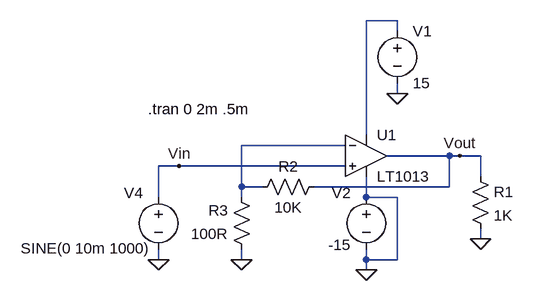
[diagram p0: schematic Opamp non-inverting.asc]
Opamp non-inverting.asc, the LTspice schematic file:
Version 4
SHEET 1 880 680
WIRE 288 -64 240 -64
WIRE 288 -48 288 -64
WIRE 288 48 288 32
WIRE 240 112 240 -64
WIRE 208 128 48 128
WIRE 368 144 272 144
WIRE 384 144 368 144
WIRE 416 144 384 144
WIRE -48 160 -80 160
WIRE 208 160 -48 160
WIRE 416 176 416 144
WIRE 48 192 48 128
WIRE 80 192 48 192
WIRE 368 192 368 144
WIRE 368 192 160 192
WIRE -80 208 -80 160
WIRE 48 208 48 192
WIRE 240 208 240 176
WIRE 288 208 240 208
WIRE 416 272 416 256
WIRE -80 304 -80 288
WIRE 48 304 48 288
WIRE 240 304 240 288
WIRE 288 304 288 208
WIRE 288 304 240 304
WIRE 240 320 240 304
FLAG 288 48 0
FLAG 240 320 0
FLAG 384 144 Vout
FLAG 416 272 0
FLAG -80 304 0
FLAG 48 304 0
FLAG -48 160 Vin
SYMBOL Opamps\\LT1013 240 80 R0
SYMATTR InstName U1
SYMBOL voltage 288 -64 R0
WINDOW 123 0 0 Left 2
WINDOW 39 0 0 Left 2
SYMATTR InstName V1
SYMATTR Value 15
SYMBOL res 400 160 R0
SYMATTR InstName R1
SYMATTR Value 1K
SYMBOL voltage -80 192 R0
WINDOW 0 -53 9 Left 2
WINDOW 3 -212 95 Left 2
WINDOW 123 0 0 Left 2
WINDOW 39 0 0 Left 2
SYMATTR InstName V4
SYMATTR Value SINE(0 10m 1000)
SYMBOL voltage 240 192 R0
WINDOW 0 -53 9 Left 2
WINDOW 3 -58 89 Left 2
WINDOW 123 0 0 Left 2
WINDOW 39 0 0 Left 2
SYMATTR InstName V2
SYMATTR Value -15
SYMBOL res 176 176 R90
WINDOW 0 0 56 VBottom 2
WINDOW 3 32 56 VTop 2
SYMATTR InstName R2
SYMATTR Value 10K
SYMBOL res 64 304 R180
WINDOW 0 36 76 Left 2
WINDOW 3 36 40 Left 2
SYMATTR InstName R3
SYMATTR Value 100R
TEXT -96 72 Left 2 !.tran 0 2m .5m

The netlist it stands for:
* Opamp non-inverting.asc
XU1 Vin N002 N001 0 Vout LT1013  ; pins In+ In- V+ V- OUT
V1 N001 0 15
R1 Vout 0 1K
V4 Vin 0 SINE(0 10m 1000)
V2 0 0 -15
R2 Vout N002 10K
R3 0 N002 100R
.tran 0 2m .5m
.lib LTC.lib
.backanno
.end